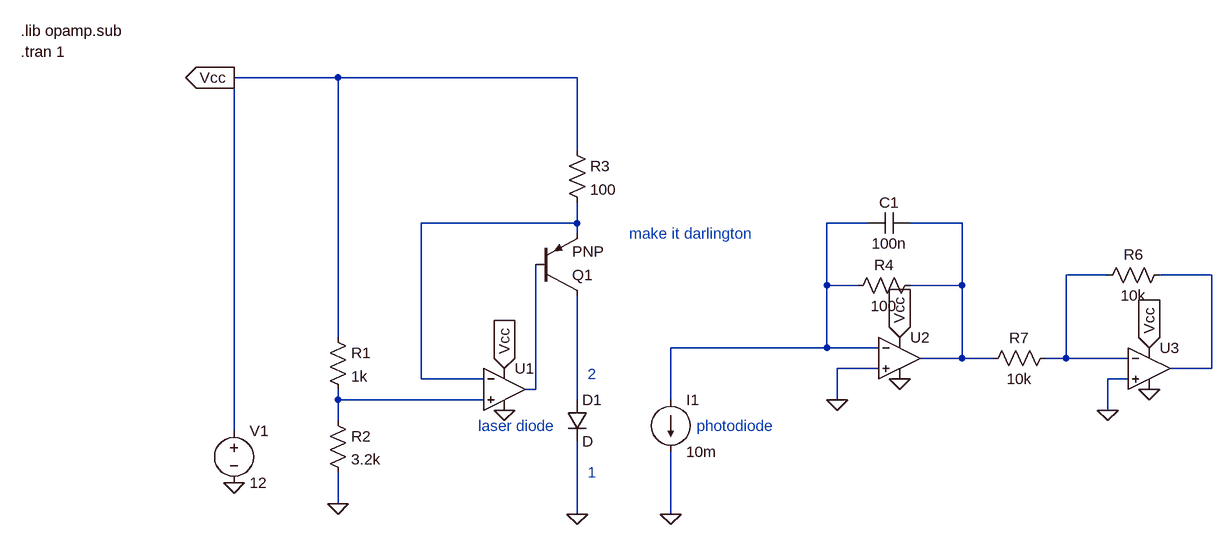
[diagram p0: schematic constant_current_source_pnp_model.asc]
constant_current_source_pnp_model.asc, the LTspice schematic file:
Version 4.1
SHEET 1 1620 680
WIRE -48 -448 -208 -448
WIRE 320 -448 -48 -448
WIRE 320 -336 320 -448
WIRE 320 -224 320 -256
WIRE 320 -224 80 -224
WIRE 768 -224 704 -224
WIRE 912 -224 832 -224
WIRE 320 -208 320 -224
WIRE 1136 -144 1072 -144
WIRE 1296 -144 1216 -144
WIRE 704 -128 704 -224
WIRE 752 -128 704 -128
WIRE 912 -128 912 -224
WIRE 912 -128 832 -128
WIRE -48 -48 -48 -448
WIRE 704 -32 704 -128
WIRE 704 -32 464 -32
WIRE 784 -32 704 -32
WIRE 912 -16 912 -128
WIRE 912 -16 848 -16
WIRE 960 -16 912 -16
WIRE 1072 -16 1072 -144
WIRE 1072 -16 1040 -16
WIRE 1168 -16 1072 -16
WIRE 784 0 720 0
WIRE 1296 0 1296 -144
WIRE 1296 0 1232 0
WIRE 80 16 80 -224
WIRE 176 16 80 16
WIRE 1168 16 1136 16
WIRE 256 32 256 -160
WIRE 256 32 240 32
WIRE -48 48 -48 32
WIRE 176 48 -48 48
WIRE 320 48 320 -112
WIRE 464 48 464 -32
WIRE 720 48 720 0
WIRE 1136 64 1136 16
WIRE -48 80 -48 48
WIRE -208 96 -208 -448
WIRE -48 208 -48 160
WIRE 320 224 320 112
WIRE 464 224 464 128
FLAG -208 176 0
FLAG -48 208 0
FLAG 320 224 0
FLAG 464 224 0
FLAG 720 48 0
FLAG 1136 64 0
FLAG 208 64 0
FLAG 816 16 0
FLAG 1200 32 0
FLAG -208 -448 Vcc
IOPIN -208 -448 Out
FLAG 208 0 Vcc
IOPIN 208 0 In
FLAG 816 -48 Vcc
IOPIN 816 -48 In
FLAG 1200 -32 Vcc
IOPIN 1200 -32 In
SYMBOL voltage -208 80 R0
WINDOW 123 0 0 Left 0
WINDOW 39 0 0 Left 0
SYMATTR InstName V1
SYMATTR Value 12
SYMBOL res -64 -64 R0
SYMATTR InstName R1
SYMATTR Value 1k
SYMBOL res -64 64 R0
SYMATTR InstName R2
SYMATTR Value 3.2k
SYMBOL res 304 -352 R0
SYMATTR InstName R3
SYMATTR Value 100
SYMBOL pnp 256 -112 M180
SYMATTR InstName Q1
SYMBOL diode 304 48 R0
SYMATTR InstName D1
SYMBOL current 464 48 R0
WINDOW 123 0 0 Left 0
WINDOW 39 0 0 Left 0
SYMATTR InstName I1
SYMATTR Value 10m
SYMBOL res 848 -144 R90
WINDOW 0 0 56 VBottom 2
WINDOW 3 32 56 VTop 2
SYMATTR InstName R4
SYMATTR Value 100
SYMBOL cap 832 -240 R90
WINDOW 0 0 32 VBottom 2
WINDOW 3 32 32 VTop 2
SYMATTR InstName C1
SYMATTR Value 100n
SYMBOL res 1232 -160 R90
WINDOW 0 0 56 VBottom 2
WINDOW 3 32 56 VTop 2
SYMATTR InstName R6
SYMATTR Value 10k
SYMBOL res 1056 -32 R90
WINDOW 0 0 56 VBottom 2
WINDOW 3 32 56 VTop 2
SYMATTR InstName R7
SYMATTR Value 10k
SYMBOL OpAmps\\UniversalOpAmp2 208 32 R0
SYMATTR InstName U1
SYMBOL OpAmps\\UniversalOpAmp2 816 -16 R0
SYMATTR InstName U2
SYMBOL OpAmps\\UniversalOpAmp2 1200 0 R0
SYMATTR InstName U3
TEXT -536 -488 Left 2 !.tran 1
TEXT -536 -520 Left 2 !.lib opamp.sub
TEXT 504 88 Left 2 ;photodiode
TEXT 168 88 Left 2 ;laser diode
TEXT 400 -208 Left 2 ;make it darlington
TEXT 336 8 Left 2 ;2
TEXT 336 160 Left 2 ;1

The netlist it stands for:
* constant_current_source_pnp_model.asc
V1 Vcc 0 12
R1 Vcc N007 1k
R2 N007 0 3.2k
R3 Vcc N001 100
Q1 N008 N006 N001 0 PNP
D1 N008 0 D
I1 N002 0 10m
R4 N003 N002 100
C1 N003 N002 100n
R6 N005 N004 10k
R7 N004 N003 10k
X§U1 N007 N001 Vcc 0 N006 level2 Avol=1Meg GBW=10Meg Slew=10Meg Ilimit=25m Rail=0 Vos=0 En=0 Enk=0 In=0 Ink=0 Rin=500Meg  ; pins In+ In- V+ V- OUT
X§U2 0 N002 Vcc 0 N003 level2 Avol=1Meg GBW=10Meg Slew=10Meg Ilimit=25m Rail=0 Vos=0 En=0 Enk=0 In=0 Ink=0 Rin=500Meg  ; pins In+ In- V+ V- OUT
X§U3 0 N004 Vcc 0 N005 level2 Avol=1Meg GBW=10Meg Slew=10Meg Ilimit=25m Rail=0 Vos=0 En=0 Enk=0 In=0 Ink=0 Rin=500Meg  ; pins In+ In- V+ V- OUT
.model D D
.lib standard.dio
.model NPN NPN
.model PNP PNP
.lib standard.bjt
.tran 1
.lib opamp.sub
* photodiode
* laser diode
* make it darlington
* 2
* 1
.lib UniversalOpAmp2.lib
.backanno
.end